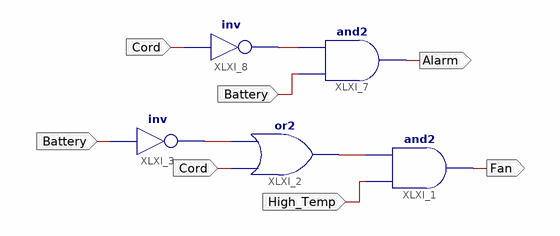
[diagram p0: schematic sheet 1]
// Xilinx ISE schematic Alarm_Fan.sch (spartan3e) as structural Verilog: 5 symbols, 5 ports
module Alarm_Fan (
  input  Battery,
  input  Cord,
  input  High_Temp,
  output Fan,
  output Alarm
);

  wire XLXN_1, XLXN_2, XLXN_14;

  and XLXI_1 (Fan, High_Temp, XLXN_2);
  or XLXI_2 (XLXN_2, Cord, XLXN_1);
  not XLXI_3 (XLXN_1, Battery);
  and XLXI_7 (Alarm, Battery, XLXN_14);
  not XLXI_8 (XLXN_14, Cord);
endmodule
